# Altium schematic sheet Thermal camera_1.SchDoc
size A4; SheetNumber: 5; SheetTotal: 6
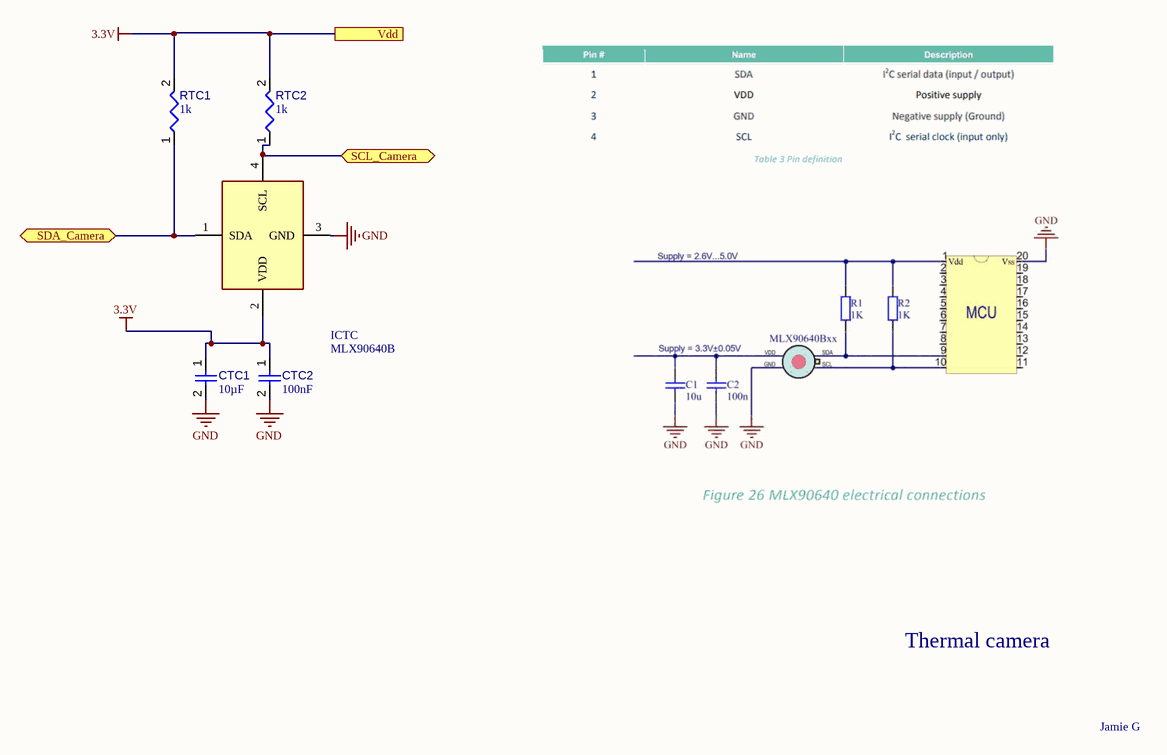
[diagram p0: Thermal camera_1.SchDoc]

## Parts
CTC1  value 10µF  [CAPC0603(1608)100_L]  (hidden comment: Capacitor 10µF +/-20% 10V 0603)
CTC2  value 100nF  [CAPC0402(1005)60_L]  (hidden comment: Capacitor 100nF +/-20% 10V 0402)
ICTC  MLX90640B  [MLX90640ESFBAA000TU]
RTC1  value 1k  [RESC0402(1005)_L]  (hidden comment: Resistor 1K +/-5 % 0402 63 mW)
RTC2  value 1k  [RESC0402(1005)_L]  (hidden comment: Resistor 1K +/-5 % 0402 63 mW)

## Ports
SCL_Camera (bidir), SDA_Camera (bidir), Vdd

## Nets
3.3V: CTC1.1 CTC2.1 ICTC.2(VDD) RTC1.2 RTC2.2 ; port Vdd
GND: CTC1.2 CTC2.2 ICTC.3(GND)
SCL_Camera: ICTC.4(SCL) RTC2.1 ; port SCL_Camera
SDA_Camera: ICTC.1(SDA) RTC1.1 ; port SDA_Camera

## Notes on the sheet
- Thermal camera
- Jamie G

## Library data of the parts
CTC1 = CMP-001-00075-4: Chip Capacitor, 10µF +/-20%, 10V, 0603, Thickness 1 mm; Tolerance: 10%; Voltage Rating: 10V; Max Operating Temperature: 85°C; Pins: 2; Case/Package: 0603; Mounting Technology: SMT; Min Operating Temperature: -55°C
CTC2 = CMP-001-00061-3: Chip Capacitor, 100nF +/-20%, 10V, 0402, Thickness 0.6 mm; Tolerance: 20%; Mounting Technology: SMT; Voltage Rating: 10V; Max Operating Temperature: 85°C; Pins: 2; Case/Package: 0402; Min Operating Temperature: -55°C
ICTC = MLX90640ESF-BAA-000-SP: Integrated Circuit; Manufacturer_Name: Melexis; Datasheet Link: https://componentsearchengine.com/Datasheets/1/MLX90640ESF-BAA-000-SP.pdf; Height: 6mm; Manufacturer_Part_Number: MLX90640ESF-BAA-000-SP; Mouser Part Number: 482-MLX90640ESFBAASP; Mouser Price/Stock: https://www.mouser.co.uk/ProductDetail/Melexis/MLX90640ESF-BAA-000-SP?qs=y6ZabgHbY%252Bz1Luyoz5kAtA%3D%3D; Arrow Part Number: MLX90640ESF-BAA-000-SP; Arrow Price/Stock: https://www.arrow.com/en/products/mlx90640esf-baa-000-sp/melexis?region=nac
RTC1 RTC2 = CMP-009-00157-3: Chip Resistor, 1 kOhms, +/-5 %, 63 mW, -55 to 155 degC, 0402; Tolerance: 5%; Power: 63mW; Case/Package: 0402; Pins: 2; Min Operating Temperature: -55°C; Max Operating Temperature: 155°C